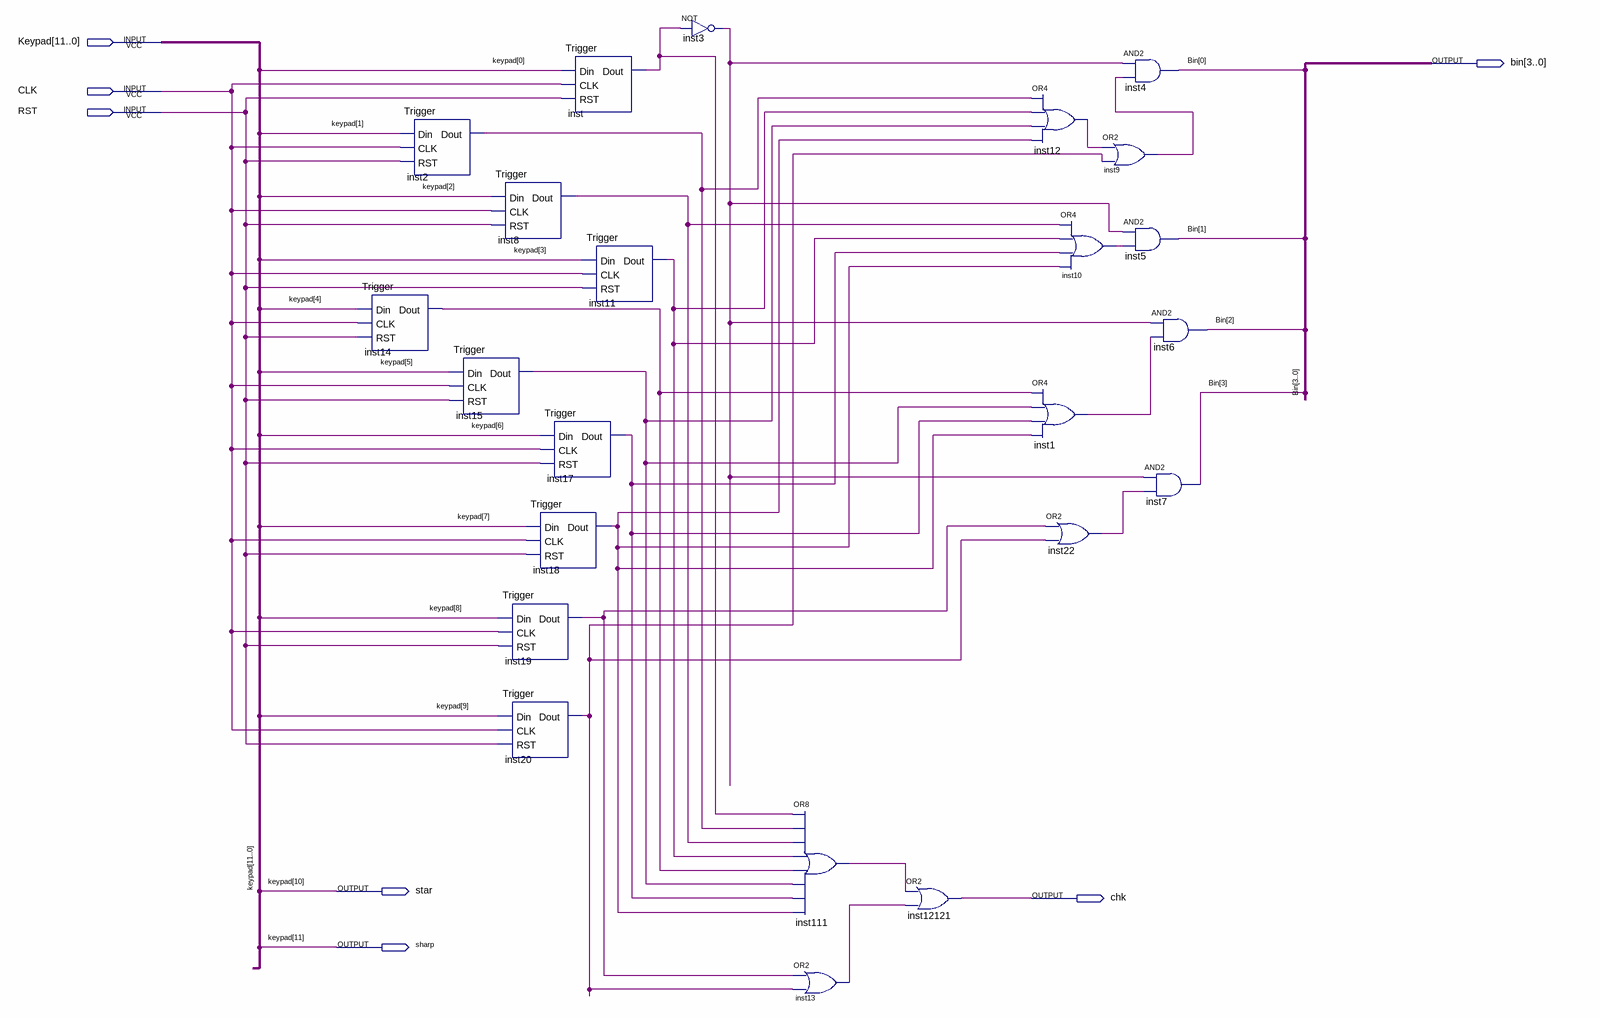
[diagram p0: schematic sheet]
// Quartus schematic Decimal_to_binary.bdf as structural Verilog: 23 symbols, 7 pins
module Decimal_to_binary (
  input  [11:0] Keypad,
  input  CLK,
  input  RST,
  output [3:0] bin,
  output star,
  output chk,
  output sharp
);

  wire inst1_out, inst2_dout, inst3_out, inst8_dout, inst9_out, inst10_out, inst11_dout, inst12_out,
       inst13_out, inst14_dout, inst15_dout, inst17_dout, inst18_dout, inst19_dout, inst20_dout, inst22_out,
       inst111_out, inst_dout;

  Trigger inst14 (.Din(Keypad[4]), .CLK(CLK), .RST(RST), .Dout(inst14_dout));
  Trigger inst2 (.Din(Keypad[1]), .CLK(CLK), .RST(RST), .Dout(inst2_dout));
  Trigger inst15 (.Din(Keypad[5]), .CLK(CLK), .RST(RST), .Dout(inst15_dout));
  Trigger inst8 (.Din(Keypad[2]), .CLK(CLK), .RST(RST), .Dout(inst8_dout));
  Trigger inst19 (.Din(Keypad[8]), .CLK(CLK), .RST(RST), .Dout(inst19_dout));
  Trigger inst20 (.Din(Keypad[9]), .CLK(CLK), .RST(RST), .Dout(inst20_dout));
  Trigger inst (.Din(Keypad[0]), .CLK(CLK), .RST(RST), .Dout(inst_dout));
  Trigger inst17 (.Din(Keypad[6]), .CLK(CLK), .RST(RST), .Dout(inst17_dout));
  Trigger inst18 (.Din(Keypad[7]), .CLK(CLK), .RST(RST), .Dout(inst18_dout));
  Trigger inst11 (.Din(Keypad[3]), .CLK(CLK), .RST(RST), .Dout(inst11_dout));
  not inst3 (inst3_out, inst_dout);
  or inst111 (inst111_out, inst_dout, inst2_dout, inst8_dout, inst11_dout, inst14_dout, inst15_dout, inst17_dout, inst18_dout);
  or inst13 (inst13_out, inst19_dout, inst20_dout);
  or inst12121 (chk, inst111_out, inst13_out);
  or inst12 (inst12_out, inst2_dout, inst11_dout, inst15_dout, inst18_dout);
  or inst10 (inst10_out, inst8_dout, inst11_dout, inst17_dout, inst18_dout);
  or inst1 (inst1_out, inst14_dout, inst15_dout, inst17_dout, inst18_dout);
  or inst22 (inst22_out, inst19_dout, inst20_dout);
  and inst4 (bin[0], inst3_out, inst9_out);
  or inst9 (inst9_out, inst12_out, inst20_dout);
  and inst5 (bin[1], inst3_out, inst10_out);
  and inst6 (bin[2], inst3_out, inst1_out);
  and inst7 (bin[3], inst3_out, inst22_out);

  assign sharp = Keypad[11];
  assign star = Keypad[10];
endmodule
